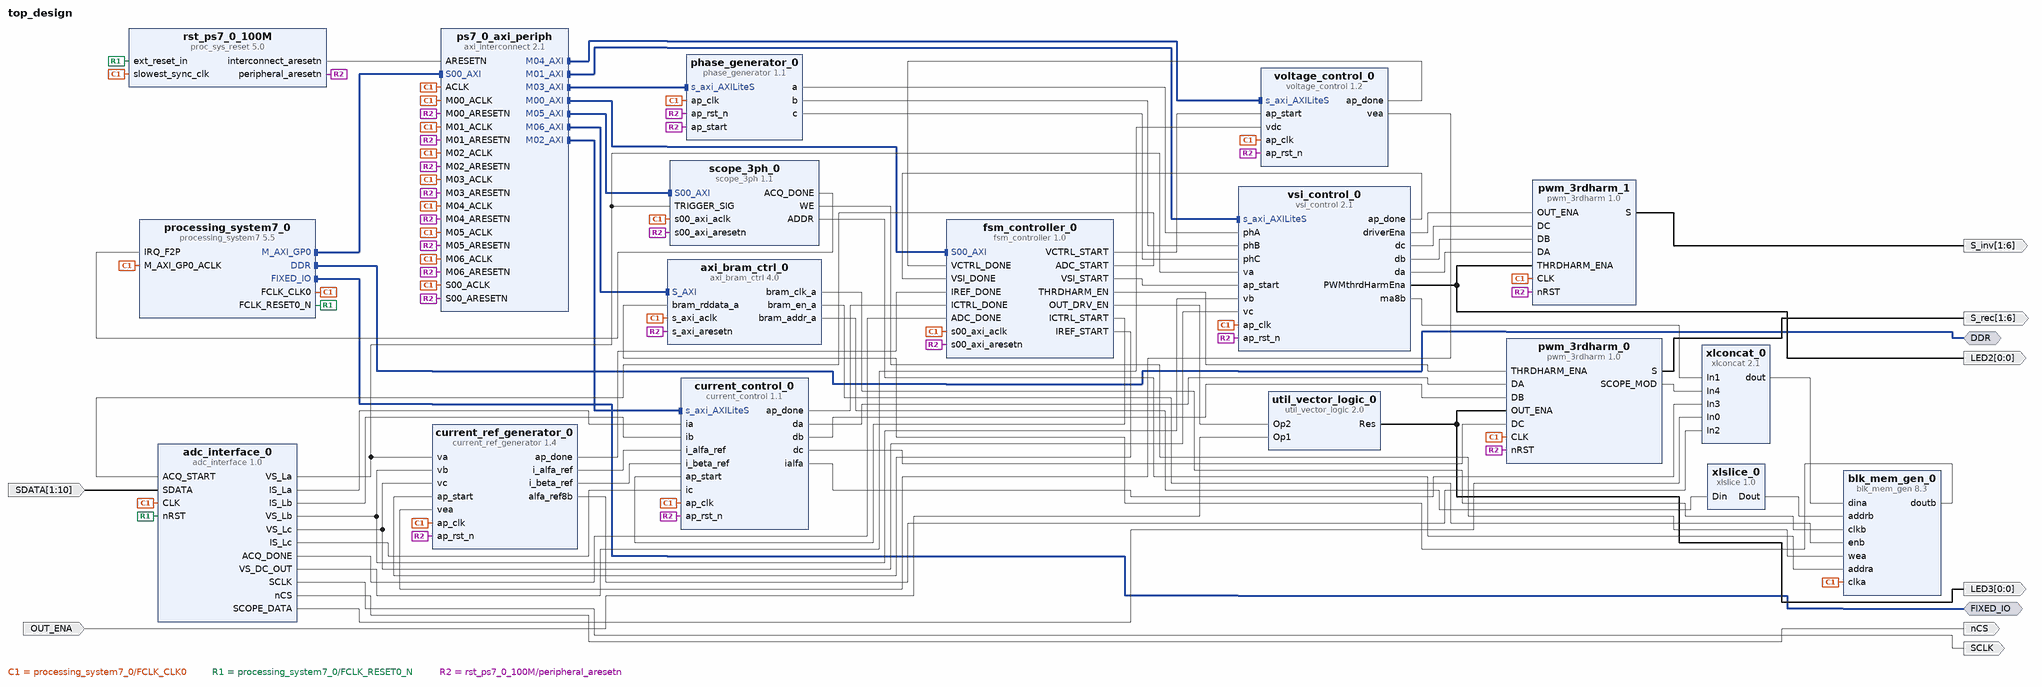
[diagram p0: block diagram of the top level]
# Vivado block design top_design, xc7z010clg400-1, Vivado 2017.2
create_bd_design top_design

create_bd_intf_port -mode Master -vlnv xilinx.com:interface:ddrx_rtl:1.0 DDR
create_bd_intf_port -mode Master -vlnv xilinx.com:display_processing_system7:fixedio_rtl:1.0 FIXED_IO
create_bd_port -dir I -from 1 -to 10 SDATA
create_bd_port -dir O SCLK
create_bd_port -dir O nCS
create_bd_port -dir O -from 1 -to 6 S_rec
create_bd_port -dir O -from 1 -to 6 S_inv
create_bd_port -dir O -from 0 -to 0 -type data LED2
create_bd_port -dir I OUT_ENA
create_bd_port -dir O -from 0 -to 0 LED3

create_bd_cell -type ip -vlnv xilinx.com:ip:processing_system7:5.5 processing_system7_0
set_property -dict [list \
  CONFIG.PCW_UIPARAM_DDR_FREQ_MHZ 525 \
  CONFIG.PCW_CRYSTAL_PERIPHERAL_FREQMHZ 50.000000 \
  CONFIG.PCW_APU_PERIPHERAL_FREQMHZ 650 \
  CONFIG.PCW_SDIO_PERIPHERAL_FREQMHZ 50 \
  CONFIG.PCW_FPGA0_PERIPHERAL_FREQMHZ 100 \
  CONFIG.PCW_USE_FABRIC_INTERRUPT 1 \
  CONFIG.PCW_IRQ_F2P_INTR 1 \
  CONFIG.PCW_PRESET_BANK1_VOLTAGE {LVCMOS 1.8V} \
  CONFIG.PCW_UIPARAM_DDR_PARTNO {MT41K128M16 JT-125} \
  CONFIG.PCW_QSPI_PERIPHERAL_ENABLE 1 \
  CONFIG.PCW_QSPI_GRP_SINGLE_SS_ENABLE 1 \
  CONFIG.PCW_QSPI_GRP_FBCLK_ENABLE 1 \
  CONFIG.PCW_ENET0_PERIPHERAL_ENABLE 1 \
  CONFIG.PCW_ENET0_ENET0_IO {MIO 16 .. 27} \
  CONFIG.PCW_ENET0_GRP_MDIO_ENABLE 1 \
  CONFIG.PCW_SD0_PERIPHERAL_ENABLE 1 \
  CONFIG.PCW_SD0_GRP_CD_ENABLE 1 \
  CONFIG.PCW_SD0_GRP_CD_IO {MIO 47} \
  CONFIG.PCW_SD0_GRP_WP_ENABLE 1 \
  CONFIG.PCW_UART1_PERIPHERAL_ENABLE 1 \
  CONFIG.PCW_TTC0_PERIPHERAL_ENABLE 1 \
  CONFIG.PCW_USB0_PERIPHERAL_ENABLE 1 \
  CONFIG.PCW_GPIO_MIO_GPIO_ENABLE 1 \
] [get_bd_cells processing_system7_0]
# 105 more settings of processing_system7_0 are not shown: defaults, MIO pin electricals, DDR timing, and values the tool derives
create_bd_cell -type ip -vlnv xilinx.com:ip:proc_sys_reset:5.0 rst_ps7_0_100M
create_bd_cell -type ip -vlnv PSC:lib3ph:adc_interface:1.0 adc_interface_0
create_bd_cell -type ip -vlnv PSC:lib3ph:fsm_controller:1.0 fsm_controller_0
create_bd_cell -type ip -vlnv PSC:lib3ph:pwm_3rdharm:1.0 pwm_3rdharm_0
create_bd_cell -type ip -vlnv PSC:lib3ph:pwm_3rdharm:1.0 pwm_3rdharm_1
create_bd_cell -type ip -vlnv PSC:lib3ph:scope_3ph:1.1 scope_3ph_0
create_bd_cell -type ip -vlnv xilinx.com:ip:blk_mem_gen:8.3 blk_mem_gen_0
set_property -dict [list \
  CONFIG.Memory_Type Simple_Dual_Port_RAM \
  CONFIG.Enable_32bit_Address false \
  CONFIG.Use_Byte_Write_Enable false \
  CONFIG.Write_Width_A 128 \
  CONFIG.Write_Depth_A 1024 \
  CONFIG.Operating_Mode_A NO_CHANGE \
  CONFIG.Enable_A Always_Enabled \
  CONFIG.Write_Width_B 32 \
  CONFIG.Read_Width_B 32 \
  CONFIG.Enable_B Use_ENB_Pin \
  CONFIG.Register_PortB_Output_of_Memory_Primitives false \
  CONFIG.Use_RSTB_Pin false \
  CONFIG.Port_B_Clock 100 \
  CONFIG.Port_B_Enable_Rate 100 \
  CONFIG.use_bram_block Stand_Alone \
] [get_bd_cells blk_mem_gen_0]
create_bd_cell -type ip -vlnv xilinx.com:ip:axi_bram_ctrl:4.0 axi_bram_ctrl_0
set_property -dict {CONFIG.SINGLE_PORT_BRAM 1} [get_bd_cells axi_bram_ctrl_0]
create_bd_cell -type ip -vlnv xilinx.com:ip:xlslice:1.0 xlslice_0
set_property -dict {CONFIG.DIN_TO 2 CONFIG.DIN_FROM 13 CONFIG.DIN_WIDTH 14 CONFIG.DOUT_WIDTH 12} [get_bd_cells xlslice_0]
create_bd_cell -type ip -vlnv xilinx.com:ip:xlconcat:2.1 xlconcat_0
set_property -dict [list \
  CONFIG.NUM_PORTS 5 \
  CONFIG.IN0_WIDTH 80 \
  CONFIG.IN1_WIDTH 8 \
  CONFIG.IN2_WIDTH 8 \
  CONFIG.IN3_WIDTH 8 \
  CONFIG.IN4_WIDTH 24 \
] [get_bd_cells xlconcat_0]
create_bd_cell -type ip -vlnv PSC:hls:current_control:1.1 current_control_0
create_bd_cell -type ip -vlnv PSC:hls:vsi_control:2.1 vsi_control_0
create_bd_cell -type ip -vlnv PSC:hls:current_ref_generator:1.4 current_ref_generator_0
create_bd_cell -type ip -vlnv PSC:hls:phase_generator:1.1 phase_generator_0
create_bd_cell -type ip -vlnv PSC:hls:voltage_control:1.2 voltage_control_0
create_bd_cell -type ip -vlnv xilinx.com:ip:axi_interconnect:2.1 ps7_0_axi_periph
set_property -dict {CONFIG.NUM_MI 7} [get_bd_cells ps7_0_axi_periph]
create_bd_cell -type ip -vlnv xilinx.com:ip:util_vector_logic:2.0 util_vector_logic_0
set_property -dict {CONFIG.C_SIZE 1 CONFIG.C_OPERATION and} [get_bd_cells util_vector_logic_0]

# ---- connections ----

connect_bd_intf_net [get_bd_intf_pins processing_system7_0/M_AXI_GP0] [get_bd_intf_pins ps7_0_axi_periph/S00_AXI]
connect_bd_intf_net [get_bd_intf_pins ps7_0_axi_periph/M00_AXI] [get_bd_intf_pins fsm_controller_0/S00_AXI]
connect_bd_intf_net [get_bd_intf_pins ps7_0_axi_periph/M01_AXI] [get_bd_intf_pins vsi_control_0/s_axi_AXILiteS]
connect_bd_intf_net [get_bd_intf_pins ps7_0_axi_periph/M02_AXI] [get_bd_intf_pins current_control_0/s_axi_AXILiteS]
connect_bd_intf_net [get_bd_intf_pins ps7_0_axi_periph/M03_AXI] [get_bd_intf_pins phase_generator_0/s_axi_AXILiteS]
connect_bd_intf_net [get_bd_intf_pins ps7_0_axi_periph/M04_AXI] [get_bd_intf_pins voltage_control_0/s_axi_AXILiteS]
connect_bd_intf_net [get_bd_intf_pins ps7_0_axi_periph/M05_AXI] [get_bd_intf_pins scope_3ph_0/S00_AXI]
connect_bd_intf_net [get_bd_intf_pins ps7_0_axi_periph/M06_AXI] [get_bd_intf_pins axi_bram_ctrl_0/S_AXI]
connect_bd_intf_net [get_bd_intf_ports DDR] [get_bd_intf_pins processing_system7_0/DDR]
connect_bd_intf_net [get_bd_intf_ports FIXED_IO] [get_bd_intf_pins processing_system7_0/FIXED_IO]
connect_bd_net [get_bd_pins processing_system7_0/FCLK_CLK0] \
  [get_bd_pins processing_system7_0/M_AXI_GP0_ACLK] [get_bd_pins rst_ps7_0_100M/slowest_sync_clk] \
  [get_bd_pins adc_interface_0/CLK] [get_bd_pins fsm_controller_0/s00_axi_aclk] [get_bd_pins pwm_3rdharm_0/CLK] \
  [get_bd_pins pwm_3rdharm_1/CLK] [get_bd_pins scope_3ph_0/s00_axi_aclk] [get_bd_pins axi_bram_ctrl_0/s_axi_aclk] \
  [get_bd_pins blk_mem_gen_0/clka] [get_bd_pins current_control_0/ap_clk] [get_bd_pins vsi_control_0/ap_clk] \
  [get_bd_pins current_ref_generator_0/ap_clk] [get_bd_pins phase_generator_0/ap_clk] [get_bd_pins voltage_control_0/ap_clk] \
  [get_bd_pins ps7_0_axi_periph/ACLK] [get_bd_pins ps7_0_axi_periph/S00_ACLK] [get_bd_pins ps7_0_axi_periph/M00_ACLK] \
  [get_bd_pins ps7_0_axi_periph/M01_ACLK] [get_bd_pins ps7_0_axi_periph/M02_ACLK] [get_bd_pins ps7_0_axi_periph/M03_ACLK] \
  [get_bd_pins ps7_0_axi_periph/M04_ACLK] [get_bd_pins ps7_0_axi_periph/M05_ACLK] [get_bd_pins ps7_0_axi_periph/M06_ACLK]
connect_bd_net [get_bd_pins processing_system7_0/FCLK_RESET0_N] [get_bd_pins rst_ps7_0_100M/ext_reset_in] [get_bd_pins adc_interface_0/nRST]
connect_bd_net [get_bd_pins rst_ps7_0_100M/peripheral_aresetn] \
  [get_bd_pins fsm_controller_0/s00_axi_aresetn] [get_bd_pins pwm_3rdharm_0/nRST] [get_bd_pins pwm_3rdharm_1/nRST] \
  [get_bd_pins scope_3ph_0/s00_axi_aresetn] [get_bd_pins axi_bram_ctrl_0/s_axi_aresetn] \
  [get_bd_pins current_control_0/ap_rst_n] [get_bd_pins vsi_control_0/ap_rst_n] \
  [get_bd_pins current_ref_generator_0/ap_rst_n] [get_bd_pins phase_generator_0/ap_rst_n] \
  [get_bd_pins phase_generator_0/ap_start] [get_bd_pins voltage_control_0/ap_rst_n] \
  [get_bd_pins ps7_0_axi_periph/S00_ARESETN] [get_bd_pins ps7_0_axi_periph/M00_ARESETN] \
  [get_bd_pins ps7_0_axi_periph/M01_ARESETN] [get_bd_pins ps7_0_axi_periph/M02_ARESETN] \
  [get_bd_pins ps7_0_axi_periph/M03_ARESETN] [get_bd_pins ps7_0_axi_periph/M04_ARESETN] \
  [get_bd_pins ps7_0_axi_periph/M05_ARESETN] [get_bd_pins ps7_0_axi_periph/M06_ARESETN]
connect_bd_net [get_bd_pins rst_ps7_0_100M/interconnect_aresetn] [get_bd_pins ps7_0_axi_periph/ARESETN]
connect_bd_net [get_bd_pins fsm_controller_0/ADC_START] [get_bd_pins adc_interface_0/ACQ_START]
connect_bd_net [get_bd_ports SDATA] [get_bd_pins adc_interface_0/SDATA]
connect_bd_net [get_bd_pins adc_interface_0/ACQ_DONE] [get_bd_pins fsm_controller_0/ADC_DONE]
connect_bd_net [get_bd_pins adc_interface_0/SCLK] [get_bd_ports SCLK]
connect_bd_net [get_bd_pins adc_interface_0/nCS] [get_bd_ports nCS]
connect_bd_net [get_bd_pins pwm_3rdharm_0/S] [get_bd_ports S_rec]
connect_bd_net [get_bd_pins pwm_3rdharm_1/S] [get_bd_ports S_inv]
connect_bd_net [get_bd_pins vsi_control_0/PWMthrdHarmEna] [get_bd_ports LED2] [get_bd_pins pwm_3rdharm_1/THRDHARM_ENA]
connect_bd_net [get_bd_pins vsi_control_0/driverEna] [get_bd_pins pwm_3rdharm_1/OUT_ENA]
connect_bd_net [get_bd_pins vsi_control_0/dc] [get_bd_pins pwm_3rdharm_1/DC]
connect_bd_net [get_bd_pins vsi_control_0/db] [get_bd_pins pwm_3rdharm_1/DB]
connect_bd_net [get_bd_pins vsi_control_0/da] [get_bd_pins pwm_3rdharm_1/DA]
connect_bd_net [get_bd_pins adc_interface_0/VS_La] \
  [get_bd_pins scope_3ph_0/TRIGGER_SIG] [get_bd_pins vsi_control_0/va] [get_bd_pins current_ref_generator_0/va]
connect_bd_net [get_bd_pins adc_interface_0/VS_Lb] [get_bd_pins vsi_control_0/vb] [get_bd_pins current_ref_generator_0/vb]
connect_bd_net [get_bd_pins adc_interface_0/VS_Lc] [get_bd_pins vsi_control_0/vc] [get_bd_pins current_ref_generator_0/vc]
connect_bd_net [get_bd_pins current_ref_generator_0/i_alfa_ref] [get_bd_pins current_control_0/i_alfa_ref]
connect_bd_net [get_bd_pins current_ref_generator_0/i_beta_ref] [get_bd_pins current_control_0/i_beta_ref]
connect_bd_net [get_bd_pins adc_interface_0/IS_La] [get_bd_pins current_control_0/ia]
connect_bd_net [get_bd_pins adc_interface_0/IS_Lb] [get_bd_pins current_control_0/ib]
connect_bd_net [get_bd_pins adc_interface_0/IS_Lc] [get_bd_pins current_control_0/ic]
connect_bd_net [get_bd_pins current_control_0/da] [get_bd_pins pwm_3rdharm_0/DA]
connect_bd_net [get_bd_pins current_control_0/db] [get_bd_pins pwm_3rdharm_0/DB]
connect_bd_net [get_bd_pins current_control_0/dc] [get_bd_pins pwm_3rdharm_0/DC]
connect_bd_net [get_bd_pins fsm_controller_0/THRDHARM_EN] [get_bd_pins pwm_3rdharm_0/THRDHARM_ENA]
connect_bd_net [get_bd_pins fsm_controller_0/VSI_START] [get_bd_pins vsi_control_0/ap_start]
connect_bd_net [get_bd_pins vsi_control_0/ap_done] [get_bd_pins fsm_controller_0/VSI_DONE]
connect_bd_net [get_bd_pins fsm_controller_0/IREF_START] [get_bd_pins current_ref_generator_0/ap_start]
connect_bd_net [get_bd_pins current_ref_generator_0/ap_done] [get_bd_pins fsm_controller_0/IREF_DONE]
connect_bd_net [get_bd_pins current_control_0/ap_done] [get_bd_pins fsm_controller_0/ICTRL_DONE]
connect_bd_net [get_bd_pins fsm_controller_0/ICTRL_START] [get_bd_pins current_control_0/ap_start]
connect_bd_net [get_bd_pins phase_generator_0/a] [get_bd_pins vsi_control_0/phA]
connect_bd_net [get_bd_pins phase_generator_0/b] [get_bd_pins vsi_control_0/phB]
connect_bd_net [get_bd_pins phase_generator_0/c] [get_bd_pins vsi_control_0/phC]
connect_bd_net [get_bd_pins voltage_control_0/ap_done] [get_bd_pins fsm_controller_0/VCTRL_DONE]
connect_bd_net [get_bd_pins fsm_controller_0/VCTRL_START] [get_bd_pins voltage_control_0/ap_start]
connect_bd_net [get_bd_pins voltage_control_0/vea] [get_bd_pins current_ref_generator_0/vea]
connect_bd_net [get_bd_pins adc_interface_0/VS_DC_OUT] [get_bd_pins voltage_control_0/vdc]
connect_bd_net [get_bd_pins scope_3ph_0/ACQ_DONE] [get_bd_pins processing_system7_0/IRQ_F2P]
connect_bd_net [get_bd_pins axi_bram_ctrl_0/bram_clk_a] [get_bd_pins blk_mem_gen_0/clkb]
connect_bd_net [get_bd_pins blk_mem_gen_0/doutb] [get_bd_pins axi_bram_ctrl_0/bram_rddata_a]
connect_bd_net [get_bd_pins axi_bram_ctrl_0/bram_en_a] [get_bd_pins blk_mem_gen_0/enb]
connect_bd_net [get_bd_pins scope_3ph_0/WE] [get_bd_pins blk_mem_gen_0/wea]
connect_bd_net [get_bd_pins scope_3ph_0/ADDR] [get_bd_pins blk_mem_gen_0/addra]
connect_bd_net [get_bd_pins xlconcat_0/dout] [get_bd_pins blk_mem_gen_0/dina]
connect_bd_net [get_bd_pins vsi_control_0/ma8b] [get_bd_pins xlconcat_0/In1]
connect_bd_net [get_bd_pins adc_interface_0/SCOPE_DATA] [get_bd_pins xlconcat_0/In0]
connect_bd_net [get_bd_pins current_ref_generator_0/alfa_ref8b] [get_bd_pins xlconcat_0/In2]
connect_bd_net [get_bd_pins current_control_0/ialfa] [get_bd_pins xlconcat_0/In3]
connect_bd_net [get_bd_pins pwm_3rdharm_0/SCOPE_MOD] [get_bd_pins xlconcat_0/In4]
connect_bd_net [get_bd_ports OUT_ENA] [get_bd_pins util_vector_logic_0/Op1]
connect_bd_net [get_bd_pins util_vector_logic_0/Res] [get_bd_ports LED3] [get_bd_pins pwm_3rdharm_0/OUT_ENA]
connect_bd_net [get_bd_pins fsm_controller_0/OUT_DRV_EN] [get_bd_pins util_vector_logic_0/Op2]
connect_bd_net [get_bd_pins axi_bram_ctrl_0/bram_addr_a] [get_bd_pins xlslice_0/Din]
connect_bd_net [get_bd_pins xlslice_0/Dout] [get_bd_pins blk_mem_gen_0/addrb]

# ---- address map ----
assign_bd_address -offset 0x40000000 -range 16K -target_address_space [get_bd_addr_spaces processing_system7_0/Data] [get_bd_addr_segs axi_bram_ctrl_0/S_AXI/Mem0]
assign_bd_address -offset 0x43C00000 -range 64K -target_address_space [get_bd_addr_spaces processing_system7_0/Data] [get_bd_addr_segs fsm_controller_0/S00_AXI/S00_AXI_reg]
assign_bd_address -offset 0x43C10000 -range 64K -target_address_space [get_bd_addr_spaces processing_system7_0/Data] [get_bd_addr_segs vsi_control_0/s_axi_AXILiteS/Reg]
assign_bd_address -offset 0x43C20000 -range 64K -target_address_space [get_bd_addr_spaces processing_system7_0/Data] [get_bd_addr_segs current_control_0/s_axi_AXILiteS/Reg]
assign_bd_address -offset 0x43C30000 -range 64K -target_address_space [get_bd_addr_spaces processing_system7_0/Data] [get_bd_addr_segs phase_generator_0/s_axi_AXILiteS/Reg]
assign_bd_address -offset 0x43C40000 -range 64K -target_address_space [get_bd_addr_spaces processing_system7_0/Data] [get_bd_addr_segs voltage_control_0/s_axi_AXILiteS/Reg]
assign_bd_address -offset 0x43C50000 -range 64K -target_address_space [get_bd_addr_spaces processing_system7_0/Data] [get_bd_addr_segs scope_3ph_0/S00_AXI/S00_AXI_reg]

validate_bd_design
save_bd_design
